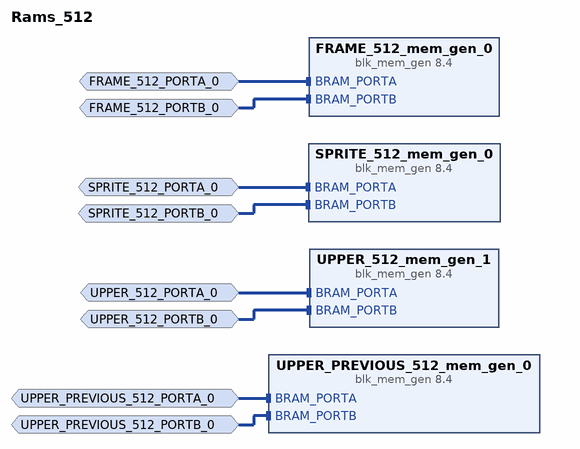
[diagram p0: block diagram of the top level]
# Vivado block design Rams_512, xc7z020clg400-1, Vivado 2022.2
create_bd_design Rams_512

create_bd_intf_port -mode Slave -vlnv xilinx.com:interface:bram_rtl:1.0 FRAME_512_PORTA_0
create_bd_intf_port -mode Slave -vlnv xilinx.com:interface:bram_rtl:1.0 FRAME_512_PORTB_0
create_bd_intf_port -mode Slave -vlnv xilinx.com:interface:bram_rtl:1.0 SPRITE_512_PORTA_0
create_bd_intf_port -mode Slave -vlnv xilinx.com:interface:bram_rtl:1.0 SPRITE_512_PORTB_0
create_bd_intf_port -mode Slave -vlnv xilinx.com:interface:bram_rtl:1.0 UPPER_PREVIOUS_512_PORTA_0
create_bd_intf_port -mode Slave -vlnv xilinx.com:interface:bram_rtl:1.0 UPPER_PREVIOUS_512_PORTB_0
create_bd_intf_port -mode Slave -vlnv xilinx.com:interface:bram_rtl:1.0 UPPER_512_PORTA_0
create_bd_intf_port -mode Slave -vlnv xilinx.com:interface:bram_rtl:1.0 UPPER_512_PORTB_0

create_bd_cell -type ip -vlnv xilinx.com:ip:blk_mem_gen:8.4 FRAME_512_mem_gen_0
set_property -dict [list \
  CONFIG.Algorithm Minimum_Area \
  CONFIG.Byte_Size 8 \
  CONFIG.Enable_A Use_ENA_Pin \
  CONFIG.Memory_Type Simple_Dual_Port_RAM \
  CONFIG.Use_Byte_Write_Enable true \
  CONFIG.Write_Depth_A 4800 \
  CONFIG.Write_Width_A 512 \
  CONFIG.use_bram_block Stand_Alone \
] [get_bd_cells FRAME_512_mem_gen_0]
create_bd_cell -type ip -vlnv xilinx.com:ip:blk_mem_gen:8.4 SPRITE_512_mem_gen_0
set_property -dict [list \
  CONFIG.Memory_Type Simple_Dual_Port_RAM \
  CONFIG.Write_Depth_A 3072 \
  CONFIG.Write_Width_A 512 \
  CONFIG.use_bram_block Stand_Alone \
] [get_bd_cells SPRITE_512_mem_gen_0]
create_bd_cell -type ip -vlnv xilinx.com:ip:blk_mem_gen:8.4 UPPER_PREVIOUS_512_mem_gen_0
set_property -dict [list \
  CONFIG.Memory_Type Simple_Dual_Port_RAM \
  CONFIG.Write_Depth_A 160 \
  CONFIG.Write_Width_A 512 \
  CONFIG.use_bram_block Stand_Alone \
] [get_bd_cells UPPER_PREVIOUS_512_mem_gen_0]
create_bd_cell -type ip -vlnv xilinx.com:ip:blk_mem_gen:8.4 UPPER_512_mem_gen_1
set_property -dict [list \
  CONFIG.Memory_Type Simple_Dual_Port_RAM \
  CONFIG.Write_Depth_A 160 \
  CONFIG.Write_Width_A 512 \
  CONFIG.use_bram_block Stand_Alone \
] [get_bd_cells UPPER_512_mem_gen_1]

# ---- connections ----

connect_bd_intf_net -intf_net BRAM_PORTA_0_1 [get_bd_intf_ports FRAME_512_PORTA_0] [get_bd_intf_pins FRAME_512_mem_gen_0/BRAM_PORTA]
connect_bd_intf_net -intf_net BRAM_PORTA_0_2 [get_bd_intf_ports SPRITE_512_PORTA_0] [get_bd_intf_pins SPRITE_512_mem_gen_0/BRAM_PORTA]
connect_bd_intf_net -intf_net BRAM_PORTA_0_3 [get_bd_intf_ports UPPER_PREVIOUS_512_PORTA_0] [get_bd_intf_pins UPPER_PREVIOUS_512_mem_gen_0/BRAM_PORTA]
connect_bd_intf_net -intf_net BRAM_PORTA_0_4 [get_bd_intf_ports UPPER_512_PORTA_0] [get_bd_intf_pins UPPER_512_mem_gen_1/BRAM_PORTA]
connect_bd_intf_net -intf_net BRAM_PORTB_0_1 [get_bd_intf_ports FRAME_512_PORTB_0] [get_bd_intf_pins FRAME_512_mem_gen_0/BRAM_PORTB]
connect_bd_intf_net -intf_net BRAM_PORTB_0_2 [get_bd_intf_ports SPRITE_512_PORTB_0] [get_bd_intf_pins SPRITE_512_mem_gen_0/BRAM_PORTB]
connect_bd_intf_net -intf_net BRAM_PORTB_0_3 [get_bd_intf_ports UPPER_PREVIOUS_512_PORTB_0] [get_bd_intf_pins UPPER_PREVIOUS_512_mem_gen_0/BRAM_PORTB]
connect_bd_intf_net -intf_net BRAM_PORTB_0_4 [get_bd_intf_ports UPPER_512_PORTB_0] [get_bd_intf_pins UPPER_512_mem_gen_1/BRAM_PORTB]

validate_bd_design
save_bd_design
